# EAGLE design FXAS21002_gyro (EAGLE 7.6.0)
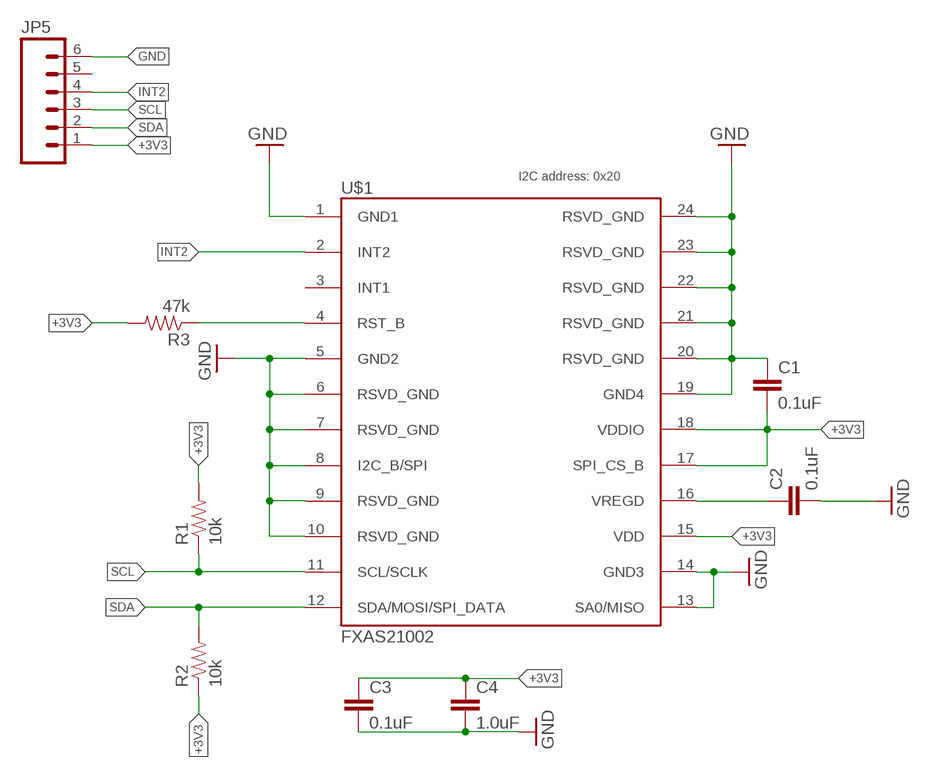
[diagram p0: schematic, sheet 1]

## Parts
C1  0.1uF  CAP0805  [0805]
C2  0.1uF  CAP0805  [0805]
C3  0.1uF  CAP0805  [0805]
C4  1.0uF  CAP0805  [0805]
JP5  M06SIP  [1X06]
R1  10k  RESISTOR0805-RES  [0805]
R2  10k  RESISTOR0805-RES  [0805]
R3  47k  RESISTOR0805-RES  [0805]
U$1  FXAS21002  [24QFN]

## Nets
+3V3: C1.2 C3.1 C4.1 JP5.1 R1.2 R2.1 R3.2 U$1.15(VDD) U$1.17(SPI_CS_B) U$1.18(VDDIO)
GND: C1.1 C2.2 C3.2 C4.2 JP5.6 U$1.1(GND1) U$1.5(GND2) U$1.6(RSVD_GND) U$1.7(RSVD_GND) U$1.8(I2C_B/SPI) U$1.9(RSVD_GND) U$1.10(RSVD_GND) U$1.13(SA0/MISO) U$1.14(GND3) U$1.19(GND4) U$1.20(RSVD_GND) U$1.21(RSVD_GND) U$1.22(RSVD_GND) U$1.23(RSVD_GND) U$1.24(RSVD_GND)
INT2: JP5.4 U$1.2(INT2)
N$1: C2.1 U$1.16(VREGD)
N$4: R3.1 U$1.4(RST_B)
SCL: JP5.3 R1.1 U$1.11(SCL/SCLK)
SDA: JP5.2 R2.2 U$1.12(SDA/MOSI/SPI_DATA)
Unconnected: JP5.5 U$1.3(INT1)

## Notes on the sheet
- I2C address: 0x20

## Library data of the parts
C1-C4 = SparkFun-Passives:CAP: Capacitor Standard 0603 ceramic capacitor, and 0.1" leaded capacitor.
JP5 = SparkFun:M06: Header 6 Standard 6-pin 0.1" header. Use with straight break away headers (SKU : PRT-00116), right angle break away headers (PRT-00553), swiss pins (PRT-00743), machine pins (PRT-00117), and female headers (PRT-00115). Molex polarized connector foot print use with SKU : PRT-08094 with associated crimp pins and housings. NOTES ON THE VARIANTS LOCK and LOCK_LONGPADS... This footprint was designed to help hold the alignment of a through-hole component (i.e. 6-pin header) while soldering it into place. You may notice that each hole has been shifted either up or down by 0.005 of an inch from it's more standard position (which is a perfectly straight line). This slight alteration caused the pins (the squares in the middle) to touch the edges of the holes. Because they are alternating, it causes a "brace" to hold the component in place. 0.005 has proven to be the perfect amount of "off-center" position when using our standard breakaway headers. Although looks a little odd when you look at the bare footprint, once you have a header in there, the alteration is very hard to notice. Also, if you push a header all the way into place, it is covered up entirely on the bottom side. This idea of altering the position of holes to aid alignment will be further integrated into the Sparkfun Library for other footprints. It can help hold any component with 3 or more connection pins.
R1-R3 = SparkFun-Passives:RESISTOR: Resistor Basic schematic elements and footprints for 0603, 1206, and PTH resistors.
U$1 = sharkdunio:FXAS21002: FXAS21002 I2C/SPI low power gyro

## Board
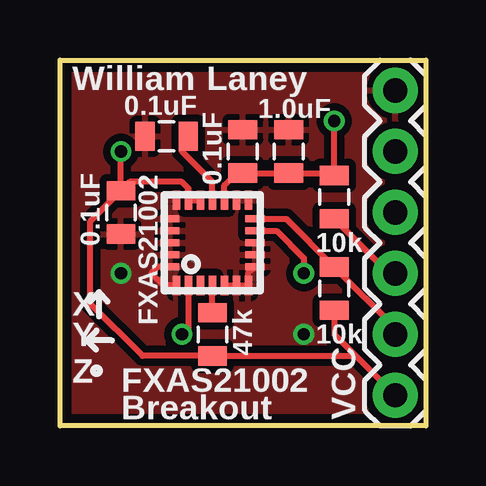
[diagram p1: board, top side]
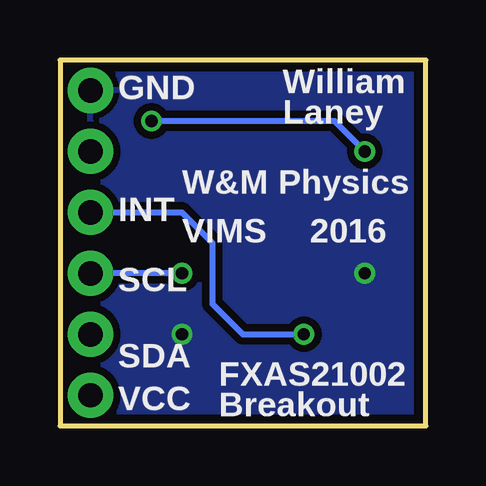
[diagram p2: board, bottom side, seen from below]

Size 15.24 x 15.24 mm. Coordinates in mm from the lower left corner, seen from the top.
Outline: 0,0 0,15.24 15.24,15.24 15.24,0 0,0
Copper layers (1*16): Top 0.0356mm / dielectric 1.5011mm / Bottom 0.0356mm
Design rules "oshpark-2layer": minimum track width 6mil, minimum drill 13mil, track to track 6mil, track to pad 6mil, pad to pad 6mil, via to via 6mil, smd to smd 6mil, copper to edge 15mil, drill to drill 6mil, minimum pad ring 7mil, minimum via ring 7mil, stop-mask expansion 2.5mil, vias tented up to drill 0mil, thermal gap 10mil

### Footprints (pad centres in the part's own frame; a part is rotated, then mirrored left to right if it is on the bottom)
0805 = smd 0.8 x 1.2: 1 -0.9,0; 2 0.9,0
1X06 = drill 1.016 pad 1.88: 1 0,0; 2 2.54,0; 3 5.08,0; 4 7.62,0; 5 10.16,0; 6 12.7,0
24QFN = smd 0.8 x 0.3: 1 -1.775,1.5; 2 -1.775,1; 3 -1.775,0.5; 4 -1.775,0; 5 -1.775,-0.5; 6 -1.775,-1; 7 -1.775,-1.5; 13 1.775,-1.5; 14 1.775,-1; 15 1.775,-0.5; 16 1.775,0; 17 1.775,0.5; 18 1.775,1; 19 1.775,1.5 | smd 0.3 x 0.8: 8 -1,-1.775; 9 -0.5,-1.775; 10 0,-1.775; 11 0.5,-1.775; 12 1,-1.775; 20 1,1.775; 21 0.5,1.775; 22 0,1.775; 23 -0.5,1.775; 24 -1,1.775

### Placement (x,y rotation side)
C1  2.54,8.89 90 top
C2  4.45,12.06 180 top
C3  7.62,11.43 90 top
C4  9.53,11.43 90 top
JP5  13.97,1.27 90 top
R1  11.43,9.53 90 top
R2  11.43,5.71 90 top
R3  6.35,3.81 270 top
U$1  6.35,7.62 90 top

### Tracks (layer width: path | path; a pad name or v marks a point on that pad's centre or on a via)
+3V3  (via drill 0.51)
  Top 0.254: U$1.17 U$1.18 5.35,9.89 5.08,10.16 2.91,10.16 C1.2 | R2.1 11.43,3.81 12.33,2.91 | 12.33,2.91 JP5.1 | v11.43,12.7 R1.2 11.32,10.53 C4.1 C3.1 7.36,10.53 6.85,10.03 U$1.15 | C1.2 v2.54,11.43 | C1.2 1.27,8.52 1.27,5.08 3.44,2.91 R3.2 12.33,2.91
  Bottom 0.254: v11.43,12.7 3.81,12.7 v2.54,11.43
GND  (via drill 0.51)
  Top 0.254: U$1.5 U$1.6 U$1.7 7.85,6.34 U$1.8 | U$1.1 4.32,5.84 3.81,6.35 4.08,6.62 U$1.24
  other vias: 2.54,6.35 10.16,3.81
  pour Bottom (isolate 0.305): 0,15.24 15.24,15.24 15.24,0 0,0
  pour Top (isolate 0.305): 0,15.24 0,0 15.24,0 15.24,15.24
INT2  (via drill 0.51)
  Top 0.254: U$1.2 5.35,4.08 v5.08,3.81
  Bottom 0.254: JP5.4 10.16,8.89 8.89,7.62 8.89,5.08 7.62,3.81 v5.08,3.81
N$1
  Top 0.254: U$1.16 6.35,10.16 5.08,11.43 5.08,11.8 C2.1
N$4
  Top 0.254: R3.1 U$1.4
SCL  (via drill 0.51)
  Top 0.254: JP5.3 13.71,6.35 R1.1 | U$1.11 9.03,8.12 10.16,6.99 v10.16,6.35
  Bottom 0.254: v10.16,6.35 JP5.3
SDA
  Top 0.254: JP5.2 13.97,4.08 R2.2 9.43,8.62 U$1.12

### Text on the board
tPlace: William | Laney | 0.1uF | 1.0uF | 0.1uF | 0.1uF | 10k | X | FXAS21002 | Y | 47k | 10k | Z | FXAS21002 | Breakout | VCC
bPlace: William | GND | Laney | W&M Physics | INT | 2016 | VIMS | SCL | FXAS21002 | SDA | VCC | Breakout